# Altium schematic sheet GPIOPins.SchDoc
size A4; SheetNumber: 6; SheetTotal: 8
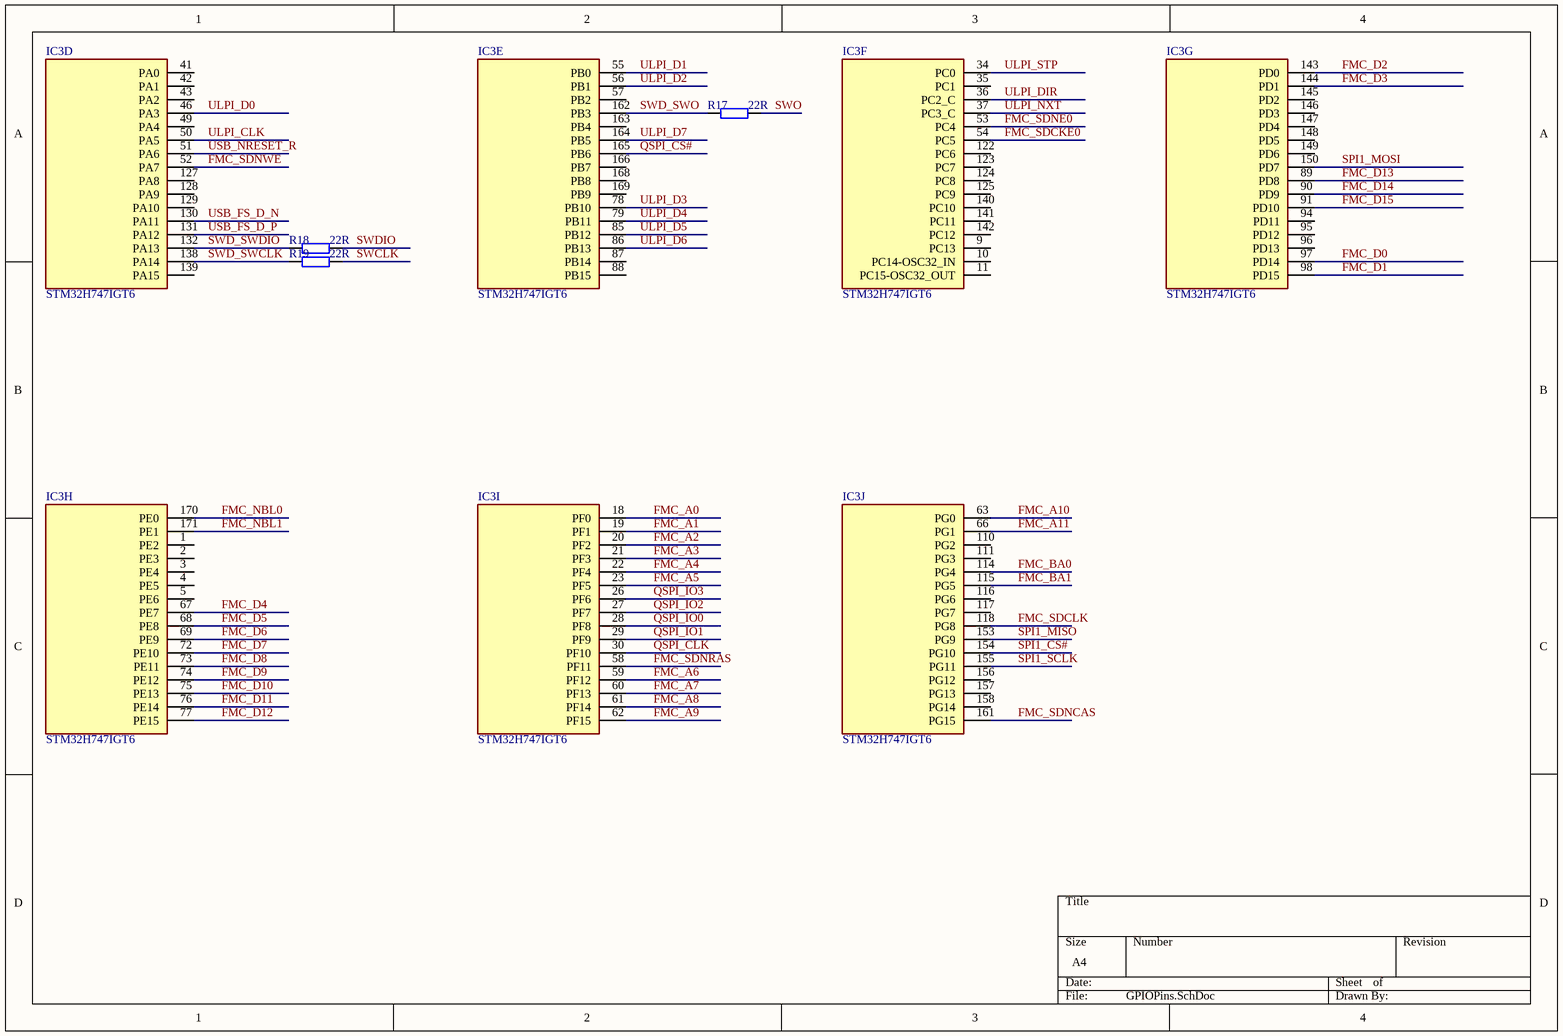
[diagram p0: GPIOPins.SchDoc]

## Parts
IC3  STM32H747IGT6  [QFP50P2600X2600X160-176N]  (parts D,E,F,G,H,I,J of 10)
R17  22R  [RES_0402]
R18  22R  [RES_0402]
R19  22R  [RES_0402]

## Nets
FMC_A0: IC3.18(PF0)
FMC_A1: IC3.19(PF1)
FMC_A2: IC3.20(PF2)
FMC_A3: IC3.21(PF3)
FMC_A4: IC3.22(PF4)
FMC_A5: IC3.23(PF5)
FMC_A6: IC3.59(PF12)
FMC_A7: IC3.60(PF13)
FMC_A8: IC3.61(PF14)
FMC_A9: IC3.62(PF15)
FMC_A10: IC3.63(PG0)
FMC_A11: IC3.66(PG1)
FMC_BA0: IC3.114(PG4)
FMC_BA1: IC3.115(PG5)
FMC_D0: IC3.97(PD14)
FMC_D1: IC3.98(PD15)
FMC_D2: IC3.143(PD0)
FMC_D3: IC3.144(PD1)
FMC_D4: IC3.67(PE7)
FMC_D5: IC3.68(PE8)
FMC_D6: IC3.69(PE9)
FMC_D7: IC3.72(PE10)
FMC_D8: IC3.73(PE11)
FMC_D9: IC3.74(PE12)
FMC_D10: IC3.75(PE13)
FMC_D11: IC3.76(PE14)
FMC_D12: IC3.77(PE15)
FMC_D13: IC3.89(PD8)
FMC_D14: IC3.90(PD9)
FMC_D15: IC3.91(PD10)
FMC_NBL0: IC3.170(PE0)
FMC_NBL1: IC3.171(PE1)
FMC_SDCKE0: IC3.54(PC5)
FMC_SDCLK: IC3.118(PG8)
FMC_SDNCAS: IC3.161(PG15)
FMC_SDNE0: IC3.53(PC4)
FMC_SDNRAS: IC3.58(PF11)
FMC_SDNWE: IC3.52(PA7)
QSPI_CLK: IC3.30(PF10)
QSPI_CS#: IC3.165(PB6)
QSPI_IO0: IC3.28(PF8)
QSPI_IO1: IC3.29(PF9)
QSPI_IO2: IC3.27(PF7)
QSPI_IO3: IC3.26(PF6)
SPI1_CS#: IC3.154(PG10)
SPI1_MISO: IC3.153(PG9)
SPI1_MOSI: IC3.150(PD7)
SPI1_SCLK: IC3.155(PG11)
SWCLK: R19.1
SWD_SWCLK: IC3.138(PA14) R19.2
SWD_SWDIO: IC3.132(PA13) R18.2
SWD_SWO: IC3.162(PB3) R17.2
SWDIO: R18.1
SWO: R17.1
ULPI_CLK: IC3.50(PA5)
ULPI_D0: IC3.46(PA3)
ULPI_D1: IC3.55(PB0)
ULPI_D2: IC3.56(PB1)
ULPI_D3: IC3.78(PB10)
ULPI_D4: IC3.79(PB11)
ULPI_D5: IC3.85(PB12)
ULPI_D6: IC3.86(PB13)
ULPI_D7: IC3.164(PB5)
ULPI_DIR: IC3.36(PC2_C)
ULPI_NXT: IC3.37(PC3_C)
ULPI_STP: IC3.34(PC0)
USB_FS_D_N: IC3.130(PA11)
USB_FS_D_P: IC3.131(PA12)
USB_NRESET_R: IC3.51(PA6)

Not connected (* = marked no-connect by the designer): IC3 1(PE2) 2(PE3) 3(PE4) 4(PE5) 5(PE6) 9(PC13) 10(PC14-OSC32_IN) 11(PC15-OSC32_OUT) 35(PC1) 41(PA0) 42(PA1) 43(PA2) 49(PA4) 57(PB2) 87(PB14) 88(PB15) 94(PD11) 95(PD12) 96(PD13) 110(PG2) 111(PG3) 116(PG6) 117(PG7) 122(PC6) 123(PC7) 124(PC8) 125(PC9) 127(PA8) 128(PA9) 129(PA10) 139(PA15) 140(PC10) 141(PC11) 142(PC12) 145(PD2) 146(PD3) 147(PD4) 148(PD5) 149(PD6) 156(PG12) 157(PG13) 158(PG14) 163(PB4) 166(PB7) 168(PB8) 169(PB9)

## Library data of the parts
IC3 = STM32H747IGT6: Integrated Circuit; Manufacturer_Name: STMicroelectronics; Datasheet Link: https://www.mouser.com/datasheet/2/389/dm00602212-1799407.pdf; Height: 1.6mm; Manufacturer_Part_Number: STM32H747IGT6; Mouser Part Number: 511-STM32H747IGT6; Mouser Price/Stock: https://www.mouser.co.uk/ProductDetail/STMicroelectronics/STM32H747IGT6?qs=%252B6g0mu59x7Kw%252BsPEalqvLg%3D%3D; Arrow Part Number: STM32H747IGT6; Arrow Price/Stock: null?region=nac
R17-R19 = RES_0402: Resistor SMD 0402; Manufacturer: *; Manufacturer Part Number: *; Distributor Link: *; LCSC: *